# EAGLE design bmp085 (EAGLE 5.11)
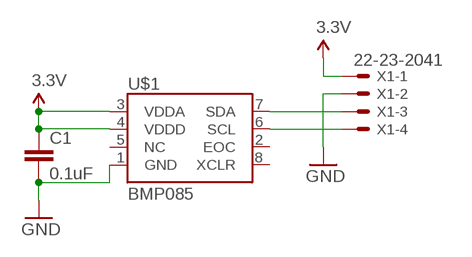
[diagram p0: schematic, sheet 1]

## Parts
C1  0.1uF  C-EUC0805K  [C0805K]
U$1  BMP085  [BMP085]
X1  22-23-2041  [22-23-2041]

## Nets
3.3V: C1.1 U$1.3(VDDA) U$1.4(VDDD) X1.1
GND: C1.2 U$1.1(GND) X1.2
N$1: U$1.7(SDA) X1.3
N$2: U$1.6(SCL) X1.4
Unconnected: U$1.2(EOC) U$1.5(NC) U$1.8(XCLR)

## Library data of the parts
C1 = rcl:C-EU: CAPACITOR, European symbol
U$1 = SparkFun:BMP085: BMP085 Pressure Sensor Great little MEMS pressure sensor. SKU: COM-09603
X1 = con-molex:22-23-2041: .100" (2.54mm) Center Header - 4 Pin; MF: MOLEX; MPN: 22-23-2041; OC_FARNELL: 1462920; OC_NEWARK: 38C0355

## Board
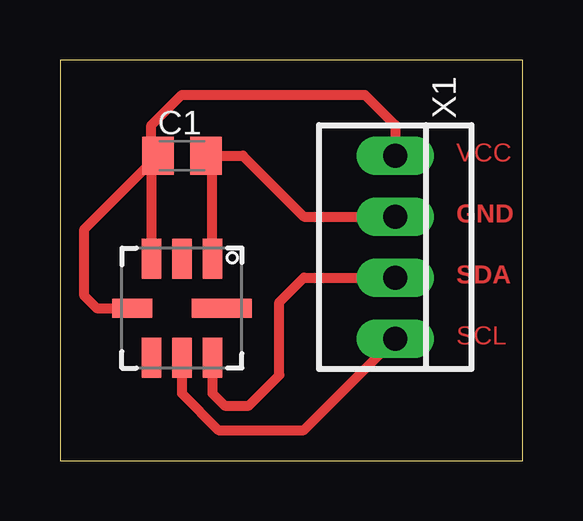
[diagram p1: board, top side]

Size 19.28 x 16.69 mm. Coordinates in mm from the lower left corner, seen from the top.
Outline: 0,0 19.28,0 19.28,16.69 0,16.69 0,0
Copper layers (1*16): Top 0.035mm / dielectric 1.5mm / Bottom 0.035mm
Design rules "default": minimum track width 12mil, minimum drill 32mil, track to track 12mil, track to pad 12mil, pad to pad 12mil, via to via 12mil, smd to smd 8mil, copper to edge 1mm, drill to drill 40mil, minimum pad ring 12mil, minimum via ring 12mil, stop-mask expansion 4mil, vias tented up to drill 0mil, thermal gap 10mil

### Footprints (pad centres in the part's own frame; a part is rotated, then mirrored left to right if it is on the bottom)
C0805K = smd 1.3 x 1.6: 1 -1,0; 2 1,0
BMP085 = smd 1.67 x 0.8: 1 -2.065,1.27; 2 -2.065,0; 3 -2.065,-1.27; 5 2.065,-1.27; 6 2.065,0; 7 2.065,1.27 | smd 0.8 x 1.67: 4 0,-2.065 | smd 0.8 x 2.5: 8 0,1.65
22-23-2041 = drill 1 long: 1 -3.81,0; 2 -1.27,0; 3 1.27,0; 4 3.81,0

### Placement (x,y rotation side)
C1  5.08,12.7 0 top
U$1  5.08,6.35 270 top
X1  13.97,8.89 270 top

### Tracks (layer width: path | path; a pad name or v marks a point on that pad's centre or on a via)
3.3V
  Top 0.406: U$1.3 3.81,12.43 C1.1 | C1.1 3.81,12.97 3.81,13.97 5.08,15.24 12.7,15.24 13.97,13.97 X1.1 | U$1.4 1.52,6.35 1.02,6.86 1.02,9.64 C1.1
GND
  Top 0.406: U$1.1 6.35,12.43 C1.2 7.62,12.7 10.16,10.16 X1.2
N$1
  Top 0.406: U$1.7 6.35,2.79 6.86,2.29 7.87,2.29 9.14,3.56 9.14,6.6 10.16,7.62 X1.3
N$2
  Top 0.406: U$1.6 5.08,2.79 6.6,1.27 10.16,1.27 X1.4

### Text on the board
Top: VCC | GND | SDA | SCL